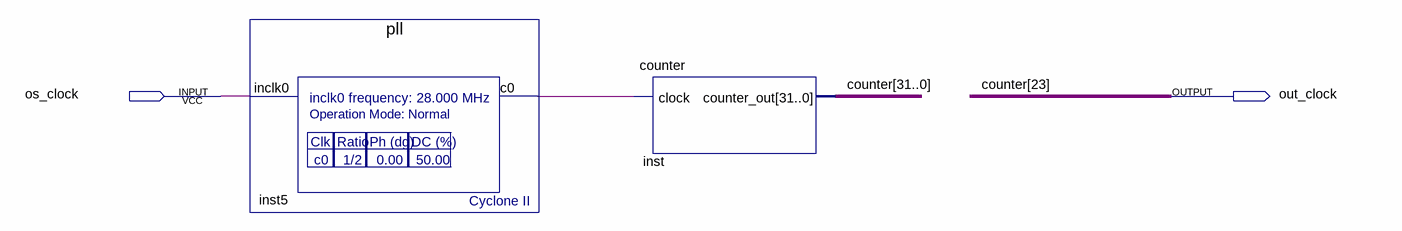
[diagram p0: schematic sheet]
// Quartus schematic clock.bdf as structural Verilog: 2 symbols, 2 pins
module clock (
  input  os_clock,
  output out_clock
);

  wire inst5_c0;
  wire [31:0] counter;

  pll inst5 (.inclk0(os_clock), .c0(inst5_c0));
  counter inst (.clock(inst5_c0), .counter_out({counter[31:24], out_clock, counter[22:0]}));

  // Other names for the same wires on the sheet: counter[23] = out_clock
endmodule
